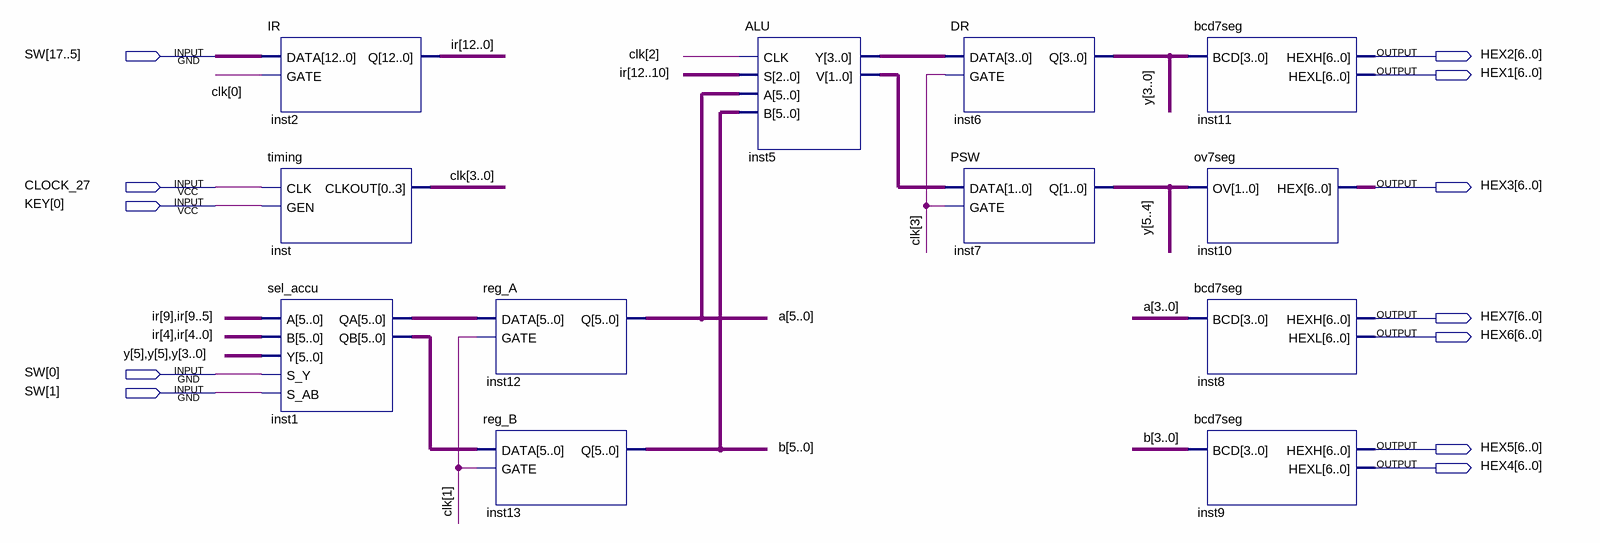
[diagram p0: schematic sheet]
// Quartus schematic CPU_6bit.bdf as structural Verilog: 12 symbols, 12 pins
module CPU_6bit (
  input  [17:0] SW,
  input  CLOCK_27,
  input  [0:0] KEY,
  output [6:0] HEX2,
  output [6:0] HEX1,
  output [6:0] HEX3,
  output [6:0] HEX7,
  output [6:0] HEX6,
  output [6:0] HEX5,
  output [6:0] HEX4
);

  wire [1:0] inst5_v;
  wire [3:0] clk, inst5_y;
  wire [5:0] a, b, inst1_qa, inst1_qb, y;
  wire [12:0] ir;

  IR inst2 (.DATA(SW[17:5]), .GATE(clk[0]), .Q(ir));
  timing inst (.CLK(CLOCK_27), .GEN(KEY[0]), .CLKOUT(clk));
  sel_accu inst1 (
    .A({{2{ir[9]}}, ir[8:5]}), .B({{2{ir[4]}}, ir[3:0]}), .Y({{2{y[5]}}, y[3:0]}), .S_Y(SW[0]), .S_AB(SW[1]),
    .QA(inst1_qa), .QB(inst1_qb));
  reg_A inst12 (.DATA(inst1_qa), .GATE(clk[1]), .Q(a));
  reg_B inst13 (.DATA(inst1_qb), .GATE(clk[1]), .Q(b));
  ALU inst5 (.CLK(clk[2]), .S(ir[12:10]), .A(a), .B(b), .Y(inst5_y), .V(inst5_v));
  DR inst6 (.DATA(inst5_y), .GATE(clk[3]), .Q(y[3:0]));
  PSW inst7 (.DATA(inst5_v), .GATE(clk[3]), .Q(y[5:4]));
  bcd7seg inst11 (.BCD(y[3:0]), .HEXH(HEX2), .HEXL(HEX1));
  ov7seg inst10 (.OV(y[5:4]), .HEX(HEX3));
  bcd7seg inst8 (.BCD(a[3:0]), .HEXH(HEX7), .HEXL(HEX6));
  bcd7seg inst9 (.BCD(b[3:0]), .HEXH(HEX5), .HEXL(HEX4));
endmodule
